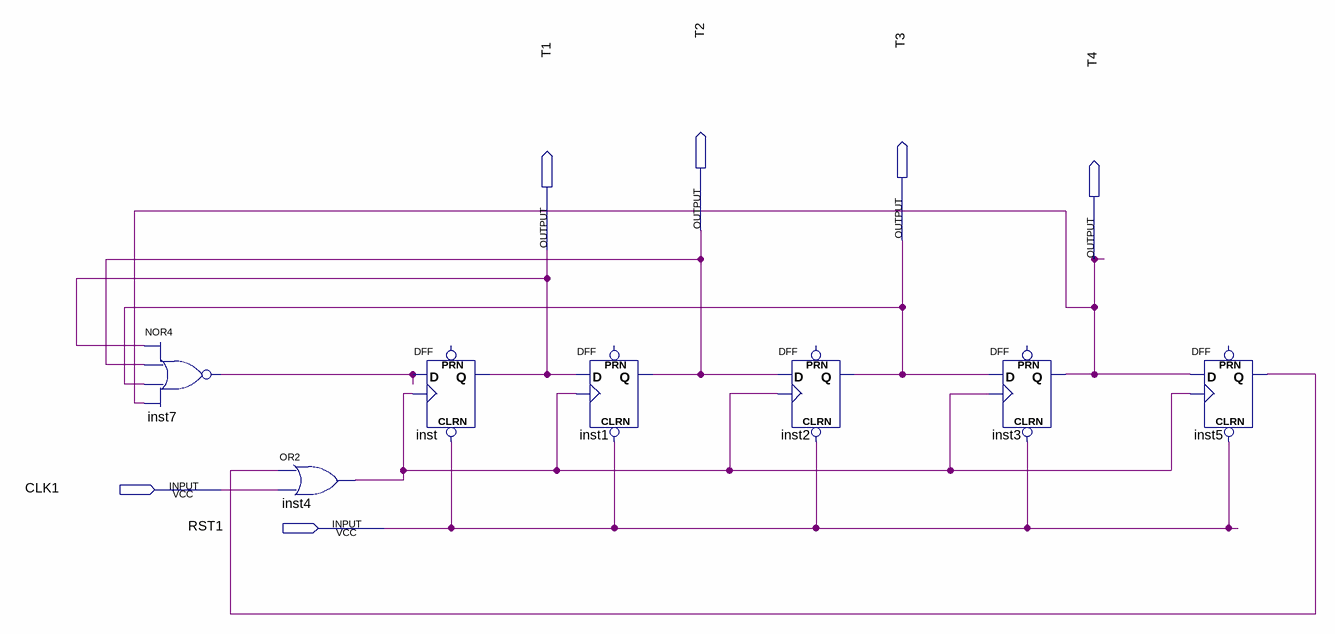
[diagram p0: schematic sheet]
// Quartus schematic exercise2.bdf as structural Verilog: 7 symbols, 6 pins
module exercise2 (
  input  CLK1,
  input  RST1,
  output T2,
  output T3,
  output T1,
  output T4
);

  wire inst4_out, inst5_q, inst7_out;

  nor inst7 (inst7_out, T1, T2, T3, T4);
  or inst4 (inst4_out, inst5_q, CLK1);
  DFF inst (.CLRN(RST1), .CLK(inst4_out), .D(inst7_out), .Q(T1));  // open: PRN
  DFF inst1 (.CLRN(RST1), .CLK(inst4_out), .D(T1), .Q(T2));  // open: PRN
  DFF inst2 (.CLRN(RST1), .CLK(inst4_out), .D(T2), .Q(T3));  // open: PRN
  DFF inst3 (.CLRN(RST1), .CLK(inst4_out), .D(T3), .Q(T4));  // open: PRN
  DFF inst5 (.CLRN(RST1), .CLK(inst4_out), .D(T4), .Q(inst5_q));  // open: PRN
endmodule
